# Altium schematic sheet mcu.SchDoc
size A3
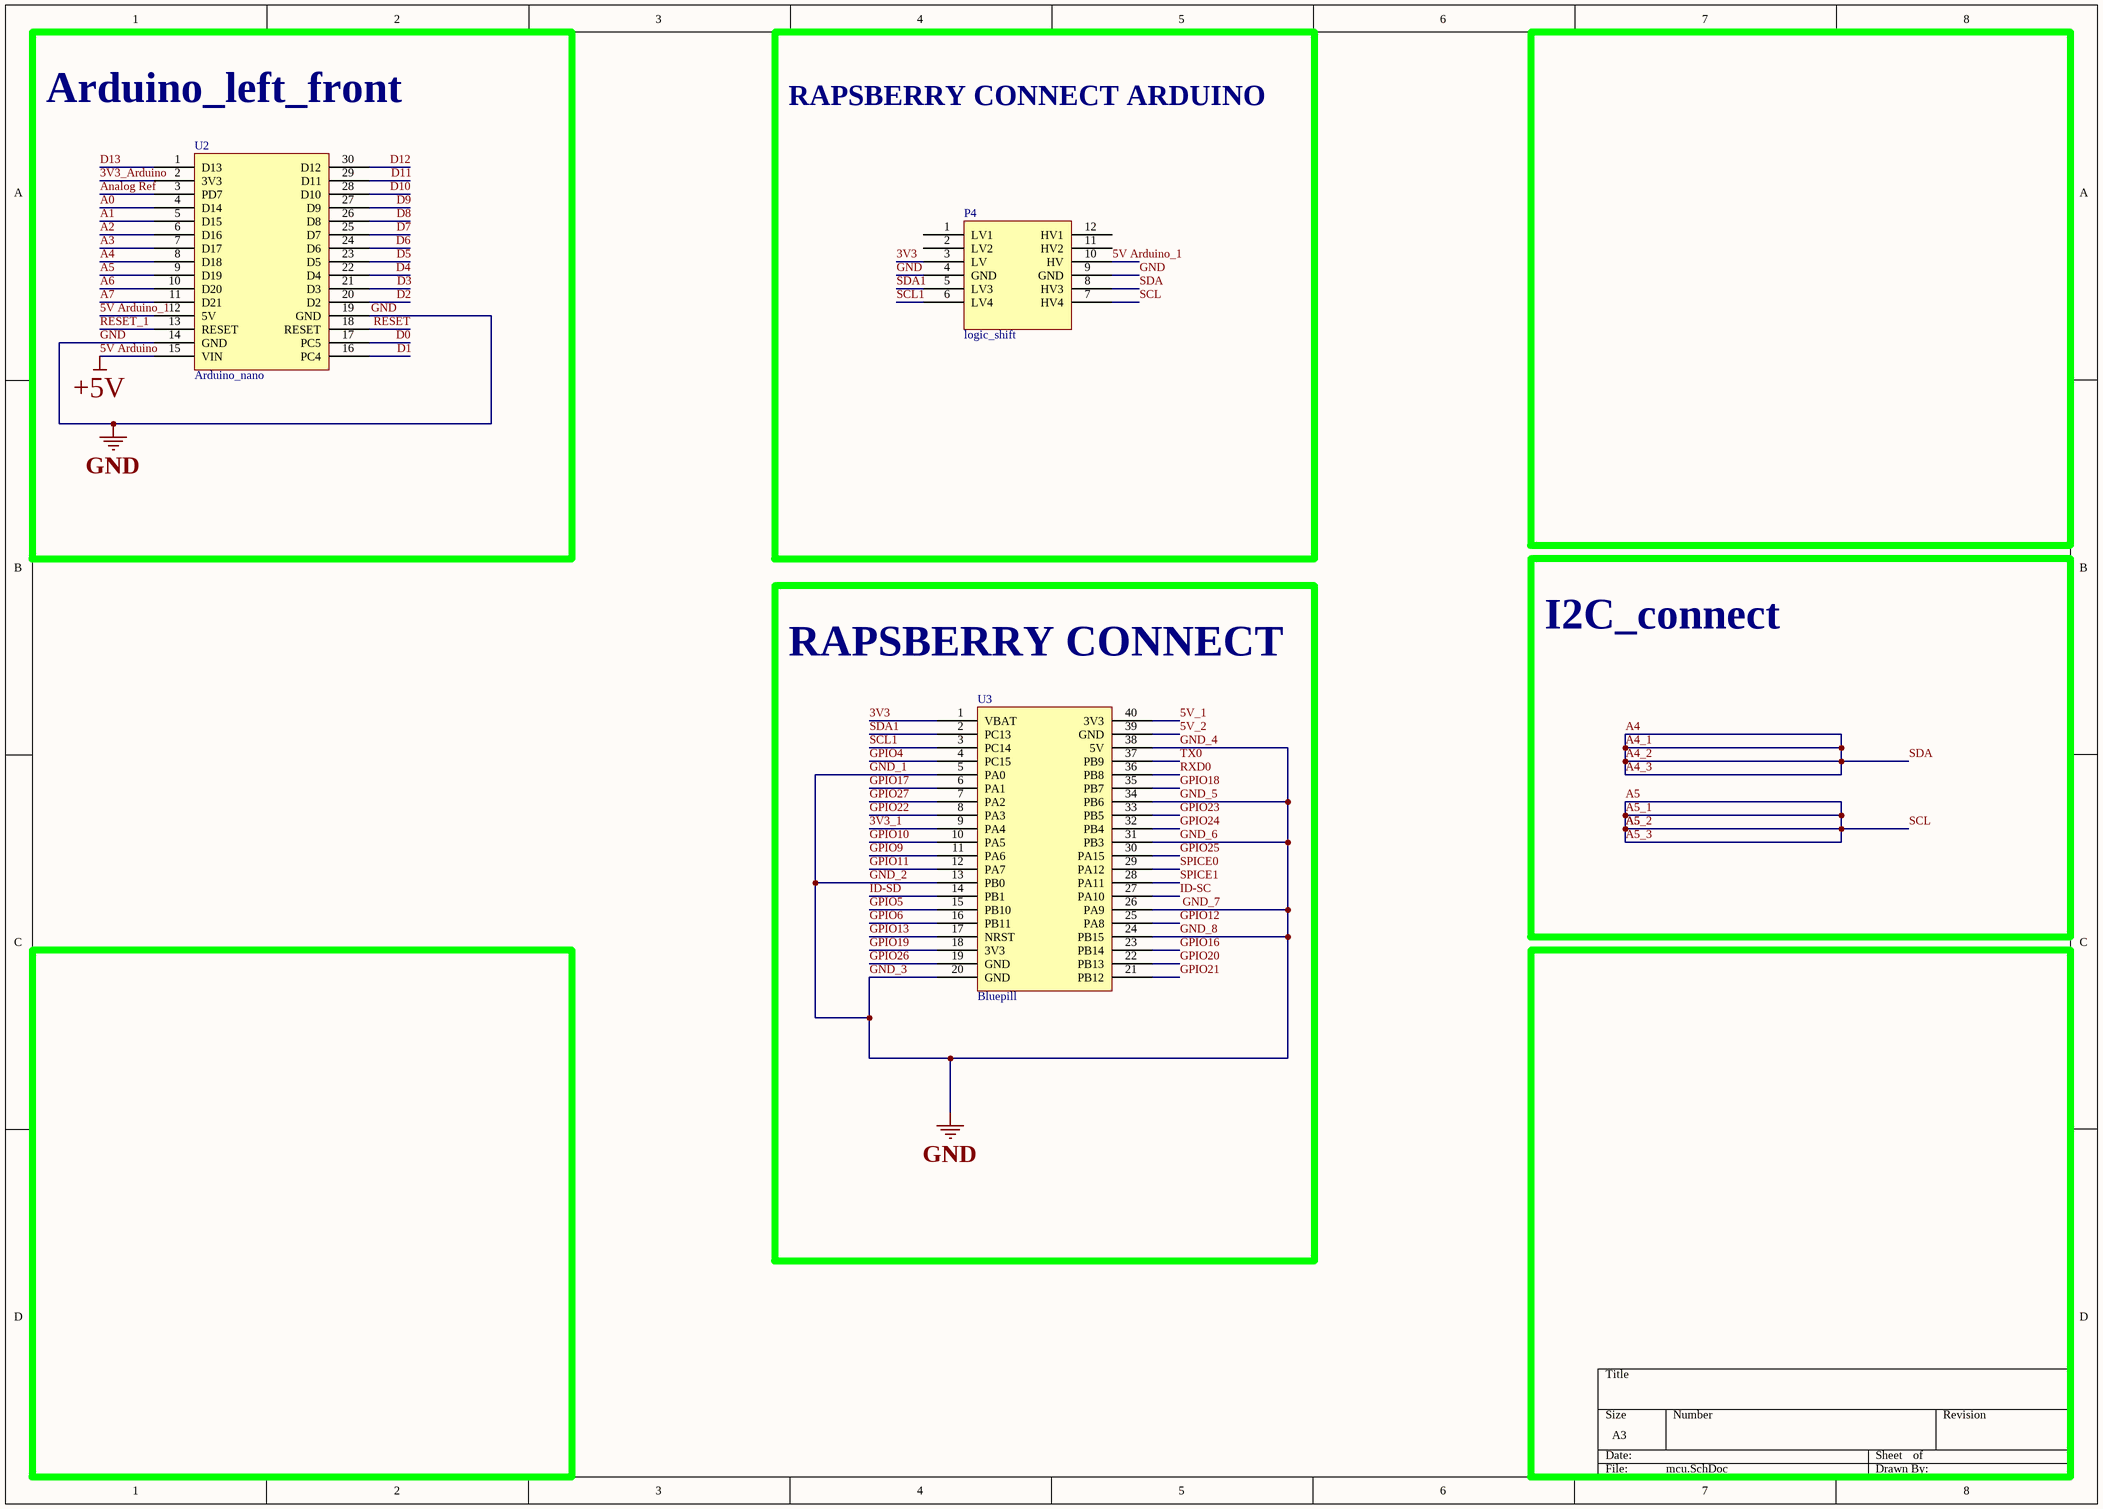
[diagram p0: mcu.SchDoc]

## Parts
P4  logic_shift  [logic_convert]
U2  Arduino_nano  [PCBComponent_1]
U3  Bluepill  [STM32F103C8T6-Bluepill]

## Blocks framed on the sheet
Arduino_left_front: U2
RAPSBERRY CONNECT ARDUINO: P4
RAPSBERRY CONNECT: U3

## Nets
5V Arduino: U2.15(VIN)  [also labelled +5V]
GND: P4.4(GND) P4.9(GND) U2.14(GND) U2.19(GND) U3.5(PA0) U3.13(PB0) U3.20(GND) U3.24(PB15) U3.26(PA9) U3.31(PB3) U3.34(PB6) U3.38(5V)  [also labelled GND_1, GND_2, GND_3, GND_4, GND_5, GND_6, GND_7, GND_8]
3V3: P4.3(LV) U3.1(VBAT)
3V3_1: U3.9(PA4)
3V3_Arduino: U2.2(3V3)
5V Arduino_1: P4.10(HV) U2.12(5V)
5V_1: U3.40(3V3)
5V_2: U3.39(GND)
A0: U2.4(D14)
A1: U2.5(D15)
A2: U2.6(D16)
A3: U2.7(D17)
A4: P4.8(HV3) U2.8(D18)  [also labelled A4_1, A4_2, A4_3, SDA]
A5: P4.7(HV4) U2.9(D19)  [also labelled A5_1, A5_2, A5_3, SCL]
A6: U2.10(D20)
A7: U2.11(D21)
Analog Ref: U2.3(PD7)
D0: U2.17(PC5)
D1: U2.16(PC4)
D2: U2.20(D2)
D3: U2.21(D3)
D4: U2.22(D4)
D5: U2.23(D5)
D6: U2.24(D6)
D7: U2.25(D7)
D8: U2.26(D8)
D9: U2.27(D9)
D10: U2.28(D10)
D11: U2.29(D11)
D12: U2.30(D12)
D13: U2.1(D13)
GPIO4: U3.4(PC15)
GPIO5: U3.15(PB10)
GPIO6: U3.16(PB11)
GPIO9: U3.11(PA6)
GPIO10: U3.10(PA5)
GPIO11: U3.12(PA7)
GPIO12: U3.25(PA8)
GPIO13: U3.17(NRST)
GPIO16: U3.23(PB14)
GPIO17: U3.6(PA1)
GPIO18: U3.35(PB7)
GPIO19: U3.18(3V3)
GPIO20: U3.22(PB13)
GPIO21: U3.21(PB12)
GPIO22: U3.8(PA3)
GPIO23: U3.33(PB5)
GPIO24: U3.32(PB4)
GPIO25: U3.30(PA15)
GPIO26: U3.19(GND)
GPIO27: U3.7(PA2)
ID-SC: U3.27(PA10)
ID-SD: U3.14(PB1)
RESET: U2.18(RESET)
RESET_1: U2.13(RESET)
RXD0: U3.36(PB8)
SCL1: P4.6(LV4) U3.3(PC14)
SDA1: P4.5(LV3) U3.2(PC13)
SPICE0: U3.29(PA12)
SPICE1: U3.28(PA11)
TX0: U3.37(PB9)

Not connected (* = marked no-connect by the designer): P4 1(LV1) 2(LV2) 11(HV2) 12(HV1)

## Notes on the sheet
- I2C_connect

## Library data of the parts
U3 = STM32F103C8T6: STM32F103C8T6, mbed-Enabled Development Bluepill STM32F1 ARM® Cortex®-M3 MCU 32-Bit Embedded Evaluation Board